# Altium schematic sheet USB DAC Processor.SchDoc
size B
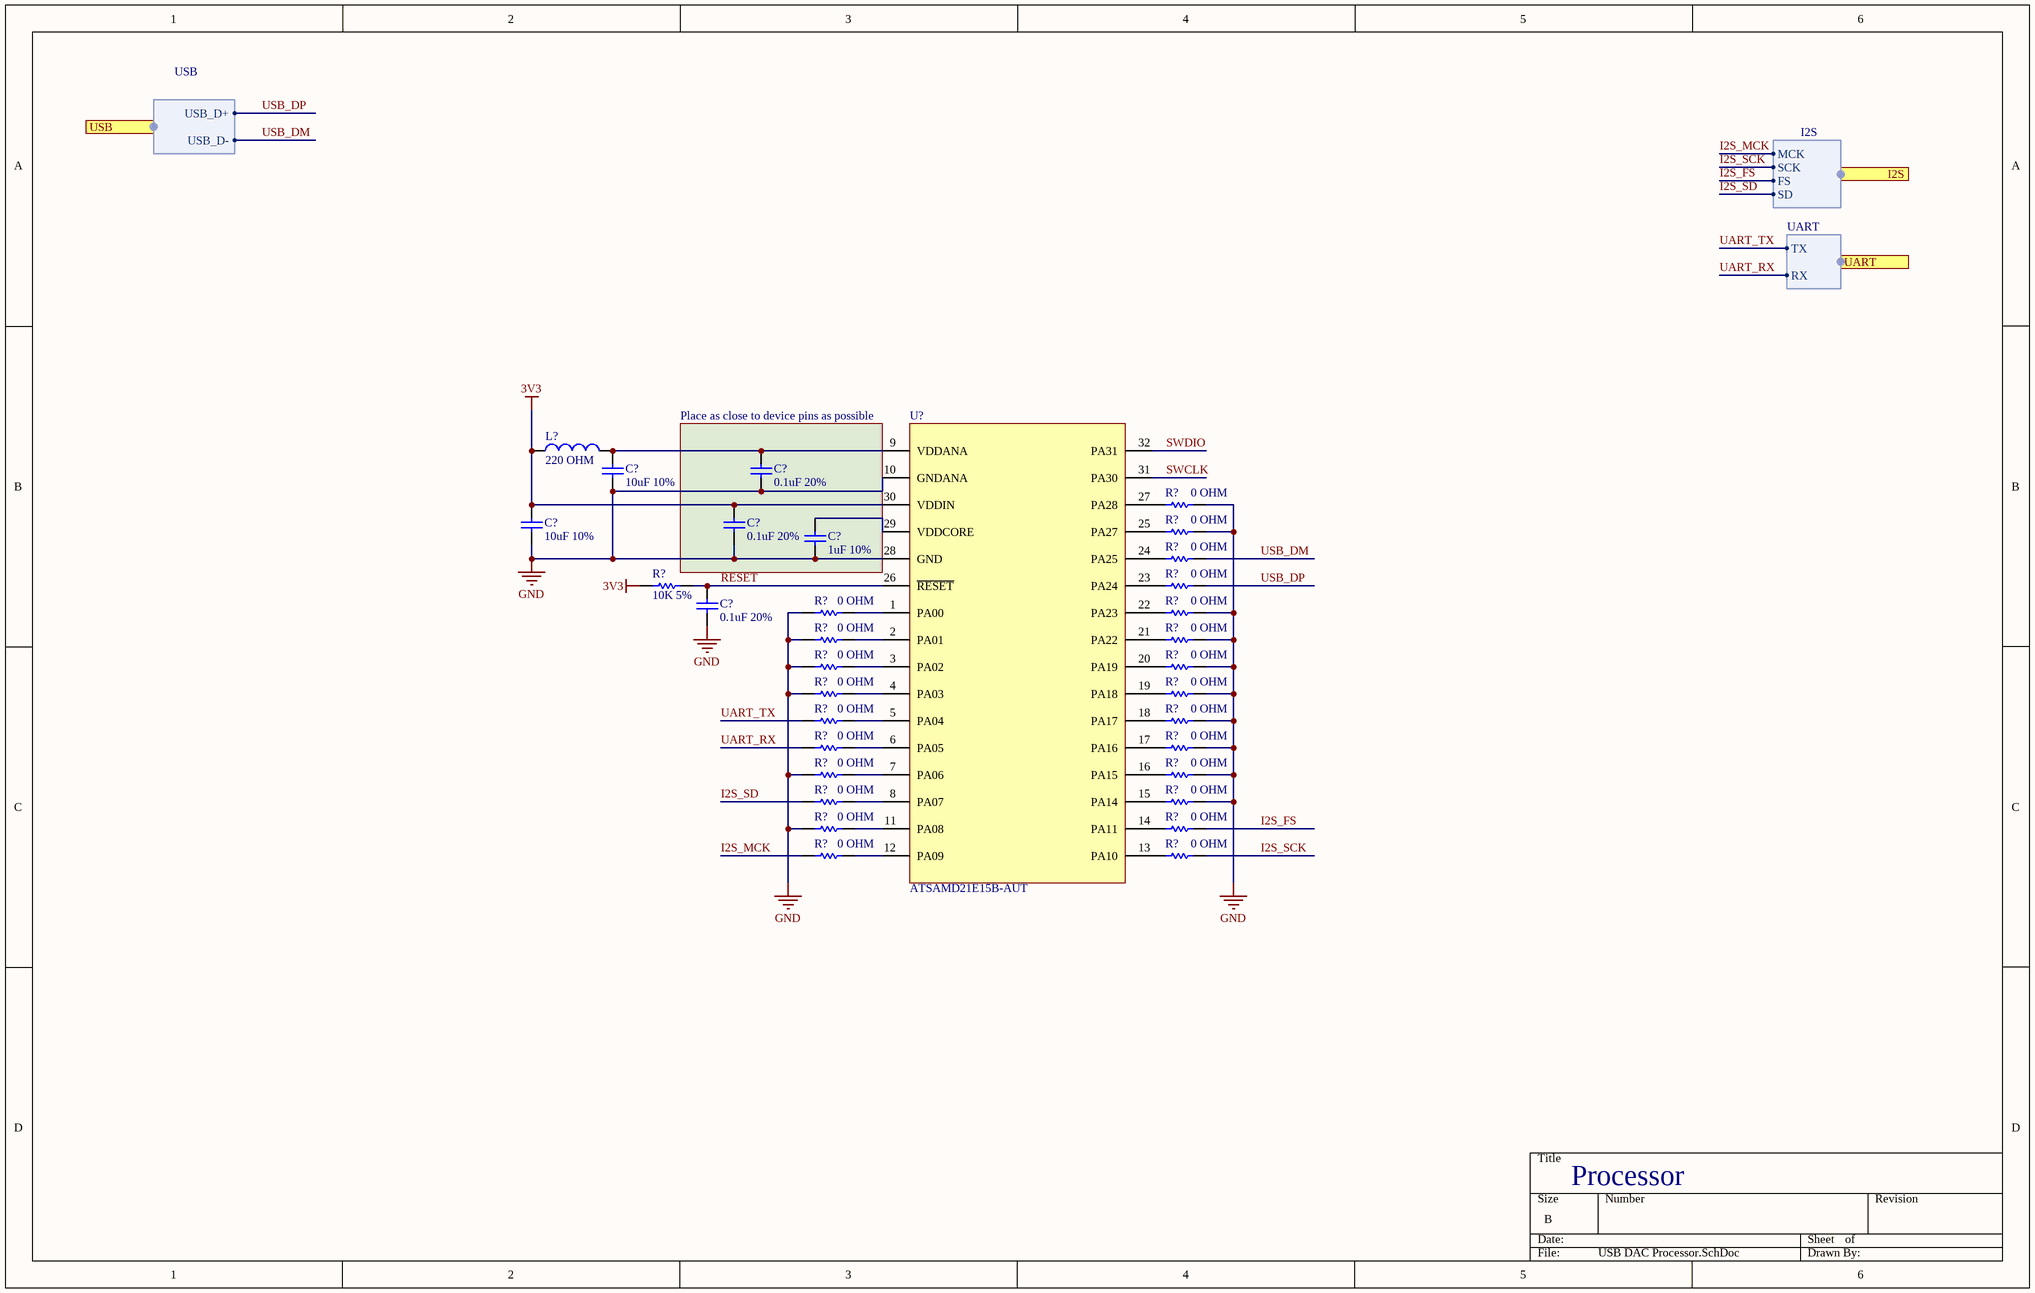
[diagram p0: USB DAC Processor.SchDoc]

## Parts
(Parts that share a designator on the sheet are numbered #1, #2 ... from top to bottom, then left to right.)
C?#1  value 10uF 10%  [C0805C106K8RACTU]  (hidden comment: C0805C106K8RACTU)
C?#2  value 0.1uF 20%  [C0603C104M4RACTU]  (hidden comment: C0603C104M4RACTU)
C?#3  value 10uF 10%  [C0805C106K8RACTU]  (hidden comment: C0805C106K8RACTU)
C?#4  value 0.1uF 20%  [C0603C104M4RACTU]  (hidden comment: C0603C104M4RACTU)
C?#5  value 1uF 10%  [C0603C105K8RACTU]  (hidden comment: C0603C105K8RACTU)
C?#6  value 0.1uF 20%  [C0603C104M4RACTU]  (hidden comment: C0603C104M4RACTU)
L?  value 220 OHM  [MPZ1608S221ATA00]  (hidden comment: MPZ1608S221ATA00)
R?#1  value 0 OHM  [RC0603JR-070RL]  (hidden comment: RC0603JR-070RL)
R?#2  value 0 OHM  [RC0603JR-070RL]  (hidden comment: RC0603JR-070RL)
R?#3  value 0 OHM  [RC0603JR-070RL]  (hidden comment: RC0603JR-070RL)
R?#4  value 10K 5%  [RC0603JR-0710KL]  (hidden comment: RC0603JR-0710KL)
R?#5  value 0 OHM  [RC0603JR-070RL]  (hidden comment: RC0603JR-070RL)
R?#6  value 0 OHM  [RC0603JR-070RL]  (hidden comment: RC0603JR-070RL)
R?#7  value 0 OHM  [RC0603JR-070RL]  (hidden comment: RC0603JR-070RL)
R?#8  value 0 OHM  [RC0603JR-070RL]  (hidden comment: RC0603JR-070RL)
R?#9  value 0 OHM  [RC0603JR-070RL]  (hidden comment: RC0603JR-070RL)
R?#10  value 0 OHM  [RC0603JR-070RL]  (hidden comment: RC0603JR-070RL)
R?#11  value 0 OHM  [RC0603JR-070RL]  (hidden comment: RC0603JR-070RL)
R?#12  value 0 OHM  [RC0603JR-070RL]  (hidden comment: RC0603JR-070RL)
R?#13  value 0 OHM  [RC0603JR-070RL]  (hidden comment: RC0603JR-070RL)
R?#14  value 0 OHM  [RC0603JR-070RL]  (hidden comment: RC0603JR-070RL)
R?#15  value 0 OHM  [RC0603JR-070RL]  (hidden comment: RC0603JR-070RL)
R?#16  value 0 OHM  [RC0603JR-070RL]  (hidden comment: RC0603JR-070RL)
R?#17  value 0 OHM  [RC0603JR-070RL]  (hidden comment: RC0603JR-070RL)
R?#18  value 0 OHM  [RC0603JR-070RL]  (hidden comment: RC0603JR-070RL)
R?#19  value 0 OHM  [RC0603JR-070RL]  (hidden comment: RC0603JR-070RL)
R?#20  value 0 OHM  [RC0603JR-070RL]  (hidden comment: RC0603JR-070RL)
R?#21  value 0 OHM  [RC0603JR-070RL]  (hidden comment: RC0603JR-070RL)
R?#22  value 0 OHM  [RC0603JR-070RL]  (hidden comment: RC0603JR-070RL)
R?#23  value 0 OHM  [RC0603JR-070RL]  (hidden comment: RC0603JR-070RL)
R?#24  value 0 OHM  [RC0603JR-070RL]  (hidden comment: RC0603JR-070RL)
R?#25  value 0 OHM  [RC0603JR-070RL]  (hidden comment: RC0603JR-070RL)
U?  ATSAMD21E15B-AUT  [ATSAMD21E15B-AUT]

## Blocks framed on the sheet
Place as close to device pins as possible: C?#2 C?#4 C?#5

## Ports
I2S (harness I2S), UART (harness UART), USB (harness USB)

## Harnesses
USB: USB_D+, USB_D-
I2S: MCK, SCK, FS, SD
UART: TX, RX

## Nets
3V3: C?#3.1 C?#4.2 L?.1 R?#4.1 U?.30(VDDIN)
GND: C?#1.2 C?#2.1 C?#3.2 C?#4.1 C?#5.1 C?#6.2 R?#1.2 R?#2.2 R?#6.1 R?#7.2 R?#8.1 R?#9.2 R?#10.1 R?#11.2 R?#12.1 R?#13.2 R?#15.2 R?#17.2 R?#18.1 R?#19.2 R?#21.2 R?#22.1 U?.10(GNDANA) U?.28(GND)
~{RESET}: C?#6.1 R?#4.2 U?.26(~{RESET})
I2S_FS: R?#23.2 ; port I2S.FS
I2S_MCK: R?#24.1 ; port I2S.MCK
I2S_SCK: R?#25.2 ; port I2S.SCK
I2S_SD: R?#20.1 ; port I2S.SD
SWCLK: U?.31(PA30)
SWDIO: U?.32(PA31)
UART_RX: R?#16.1 ; port UART.RX
UART_TX: R?#14.1 ; port UART.TX
USB_DM: R?#3.2 ; port USB.USB_D-
USB_DP: R?#5.2 ; port USB.USB_D+
NetC?#1_1: C?#1.1 C?#2.2 L?.2 U?.9(VDDANA)
NetC?#5_2: C?#5.2 U?.29(VDDCORE)
NetR?#1_1: R?#1.1 U?.27(PA28)
NetR?#2_1: R?#2.1 U?.25(PA27)
NetR?#3_1: R?#3.1 U?.24(PA25)
NetR?#5_1: R?#5.1 U?.23(PA24)
NetR?#6_2: R?#6.2 U?.1(PA00)
NetR?#7_1: R?#7.1 U?.22(PA23)
NetR?#8_2: R?#8.2 U?.2(PA01)
NetR?#9_1: R?#9.1 U?.21(PA22)
NetR?#10_2: R?#10.2 U?.3(PA02)
NetR?#11_1: R?#11.1 U?.20(PA19)
NetR?#12_2: R?#12.2 U?.4(PA03)
NetR?#13_1: R?#13.1 U?.19(PA18)
NetR?#14_2: R?#14.2 U?.5(PA04)
NetR?#15_1: R?#15.1 U?.18(PA17)
NetR?#16_2: R?#16.2 U?.6(PA05)
NetR?#17_1: R?#17.1 U?.17(PA16)
NetR?#18_2: R?#18.2 U?.7(PA06)
NetR?#19_1: R?#19.1 U?.16(PA15)
NetR?#20_2: R?#20.2 U?.8(PA07)
NetR?#21_1: R?#21.1 U?.15(PA14)
NetR?#22_2: R?#22.2 U?.11(PA08)
NetR?#23_1: R?#23.1 U?.14(PA11)
NetR?#24_2: R?#24.2 U?.12(PA09)
NetR?#25_1: R?#25.1 U?.13(PA10)

## Notes on the sheet
- Processor

## Library data of the parts
C?#1 C?#3 = C0805C106K8RACTU: CAP CER 10UF 10V X7R 0805; Manufacturer: KEMET; Vendor: Digikey; Vendor PN: 399-7411-6-ND; Manufacturer PN: C0805C106K8RACTU
C?#2 C?#4 C?#6 = C0603C104M4RACTU: CAP CER 0.1UF 20% 16V X7R 0603; Manufacturer: KEMET; Vendor: Digikey; Vendor PN: 399-1099-1-ND; Manufacturer PN: C0603C104M4RACTU
C?#5 = C0603C105K8RACTU: CAP CER 1UF 10V X7R 0603; Manufacturer: KEMET; Vendor: Digikey; Vendor PN: 399-11133-1-ND; Manufacturer PN: C0603C105K8RACTU
L? = MPZ1608S221ATA00: FERRITE BEAD 220 OHM 0603 1LN; Manufacturer: TDK Corporation; Vendor: Digikey; Vendor PN: 445-1565-1-ND; Manufacturer PN: MPZ1608S221ATA00
R?#1-R?#3 R?#5-R?#25 = RC0603JR-070RL: RES SMD 0 OHM JUMPER 1/10W 0603; Manufacturer: Yageo; Vendor: Digikey; Vendor PN: 311-0.0GRCT-ND; Manufacturer PN: RC0603JR-070RL
R?#4 = RC0603JR-0710KL: RES SMD 10K OHM 5% 1/10W 0603; Manufacturer: Yageo; Vendor: Digikey; Vendor PN: 311-10KGRCT-ND; Manufacturer PN: RC0603JR-0710KL
U? = ATSAMD21E15B-AUT: IC MCU 32BIT 32KB FLASH 32TQFP; Manufacturer: Microchip Technology; Vendor: Digkey; Vendor PN: ATSAMD21E15B-AUTCT-ND; Manufacturer PN: ATSAMD21E15B-AUT; Value: *